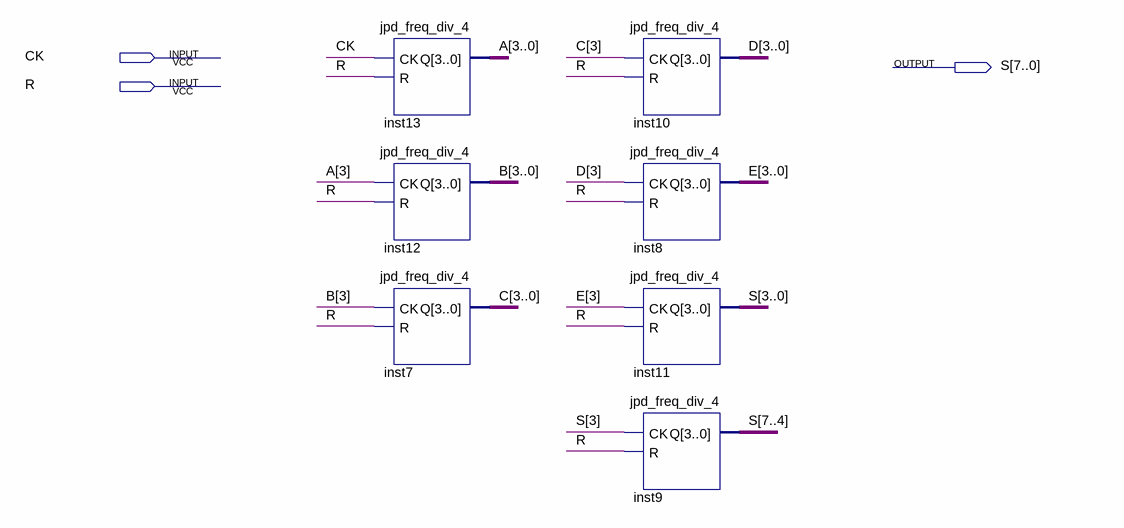
[diagram p0: schematic sheet]
// Quartus schematic jpd_freq_div_28.bdf as structural Verilog: 7 symbols, 3 pins
module jpd_freq_div_28 (
  input  CK,
  input  R,
  output [7:0] S
);

  wire [3:0] A, B, C, D, E;

  jpd_freq_div_4 inst13 (.CK(CK), .R(R), .Q(A));
  jpd_freq_div_4 inst12 (.CK(A[3]), .R(R), .Q(B));
  jpd_freq_div_4 inst7 (.CK(B[3]), .R(R), .Q(C));
  jpd_freq_div_4 inst10 (.CK(C[3]), .R(R), .Q(D));
  jpd_freq_div_4 inst8 (.CK(D[3]), .R(R), .Q(E));
  jpd_freq_div_4 inst11 (.CK(E[3]), .R(R), .Q(S[3:0]));
  jpd_freq_div_4 inst9 (.CK(S[3]), .R(R), .Q(S[7:4]));
endmodule
